# Altium schematic sheet Connectors.SchDoc: Science - Connectors
size Letter; DrawnBy: C.Arjune, K.Hong; Organization: UW Robotics; Address1: 200 University Avenue; Address2: Waterloo; Address3: Ontario; Address4: Canada N2L 3G6; SheetNumber: 2; SheetTotal: 5
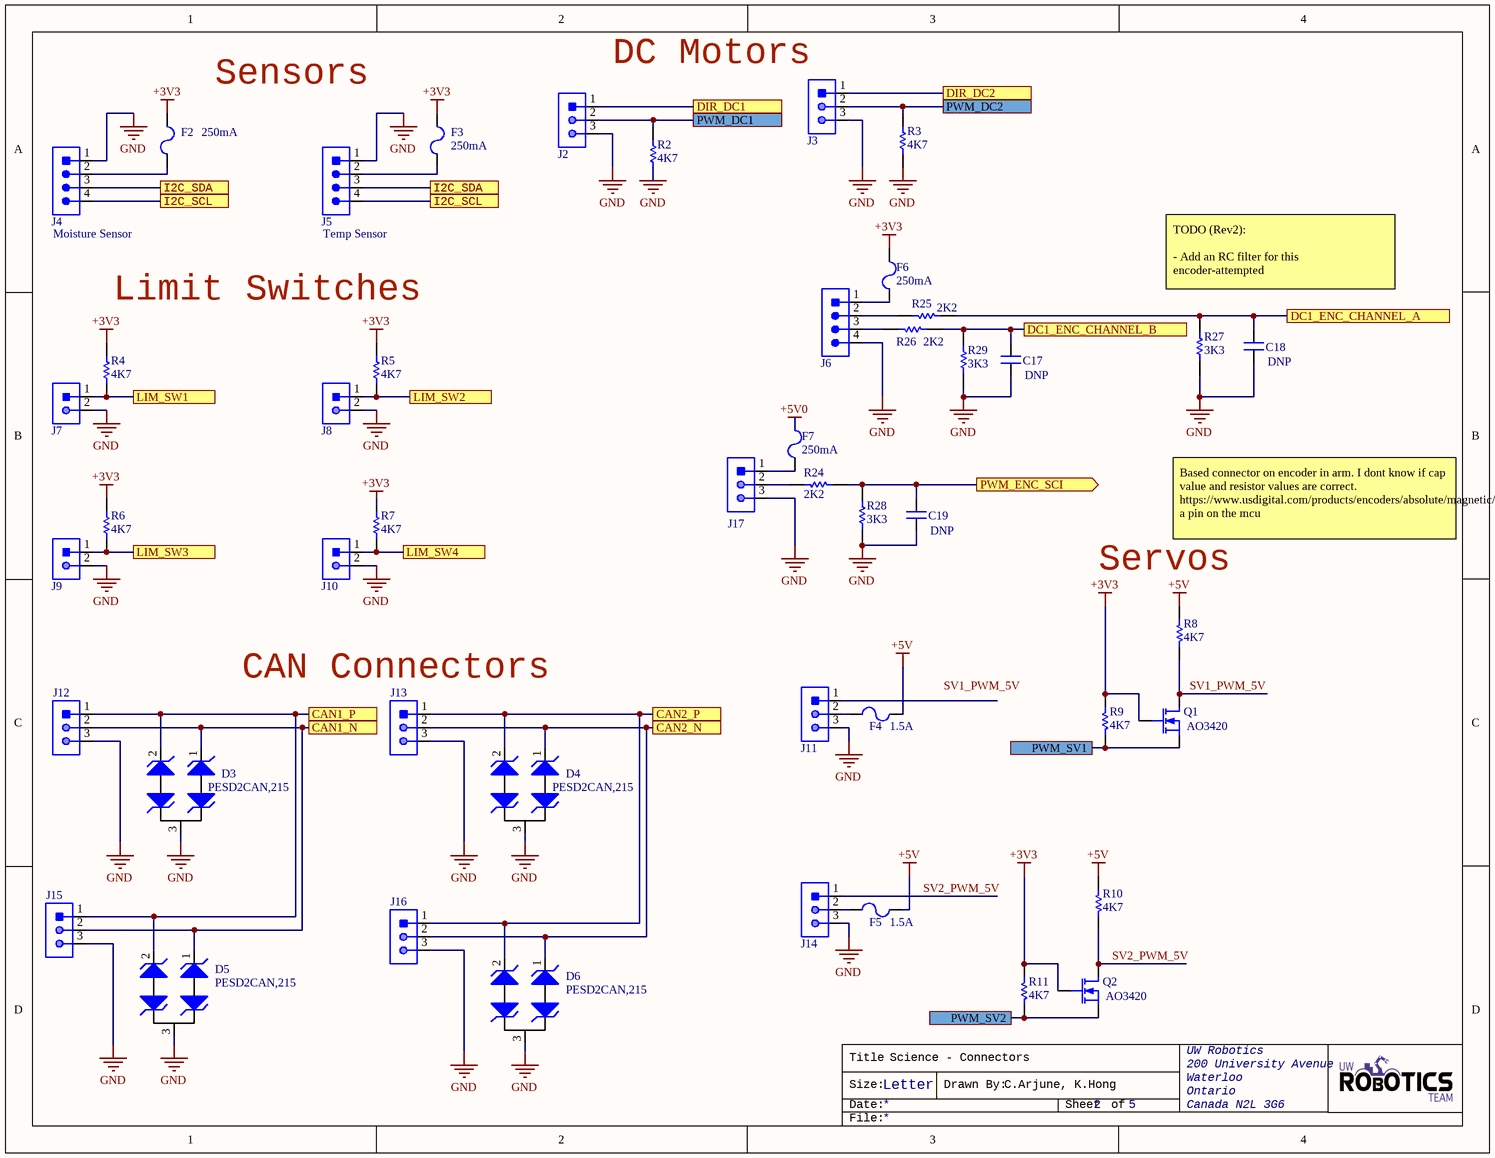
[diagram p0: Connectors.SchDoc]

## Parts
C17  value DNP  [CAPC0603(1608)55_N]  (hidden comment: CAP_0.1uF_50V_0603)
C18  value DNP  [CAPC0603(1608)55_N]  (hidden comment: CAP_0.1uF_50V_0603)
C19  value DNP  [CAPC0603(1608)55_N]  (hidden comment: CAP_0.1uF_50V_0603)
D3  Manufacturer Part Number: PESD2CAN,215  [TVS_DIODE_CAN]  (hidden comment: TVS_DIODE_CAN)
D4  Manufacturer Part Number: PESD2CAN,215  [TVS_DIODE_CAN]  (hidden comment: TVS_DIODE_CAN)
D5  Manufacturer Part Number: PESD2CAN,215  [TVS_DIODE_CAN]  (hidden comment: TVS_DIODE_CAN)
D6  Manufacturer Part Number: PESD2CAN,215  [TVS_DIODE_CAN]  (hidden comment: TVS_DIODE_CAN)
F2  Current Rating: 250mA  [FUSE_0603]  (hidden comment: FUSE_250mA_0603)
F3  Current Rating: 250mA  [FUSE_0603]  (hidden comment: FUSE_250mA_0603)
F4  Current Rating: 1.5A  [FUSE_0603]  (hidden comment: FUSE_1.5A_0603)
F5  Current Rating: 1.5A  [FUSE_0603]  (hidden comment: FUSE_1.5A_0603)
F6  Current Rating: 250mA  [FUSE_0603]  (hidden comment: FUSE_250mA_0603)
F7  Current Rating: 250mA  [FUSE_0603]  (hidden comment: FUSE_250mA_0603)
J2  CON_3M_SM4  [JST-B3B-SM4-TB]  (value not drawn)
J3  CON_3M_SM4  [JST-B3B-SM4-TB]  (value not drawn)
J4  Moisture Sensor  [JST-B4B-SM4-TB]
J5  Temp Sensor  [JST-B4B-SM4-TB]
J6  CON_4M_SM4  [JST-B4B-SM4-TB]  (value not drawn)
J7  CON_2M_SM4  [JST-B2B-SM4-TB]  (value not drawn)
J8  CON_2M_SM4  [JST-B2B-SM4-TB]  (value not drawn)
J9  CON_2M_SM4  [JST-B2B-SM4-TB]  (value not drawn)
J10  CON_2M_SM4  [JST-B2B-SM4-TB]  (value not drawn)
J11  CON_3M_SM4  [JST-B3B-SM4-TB]  (value not drawn)
J12  CON_3M_SM4  [JST-B3B-SM4-TB]  (value not drawn)
J13  CON_3M_SM4  [JST-B3B-SM4-TB]  (value not drawn)
J14  CON_3M_SM4  [JST-B3B-SM4-TB]  (value not drawn)
J15  CON_3M_SM4  [JST-B3B-SM4-TB]  (value not drawn)
J16  CON_3M_SM4  [JST-B3B-SM4-TB]  (value not drawn)
J17  CON_3M_SM4  [JST-B3B-SM4-TB]  (value not drawn)
Q1  MPN: AO3420  [NMOS_SOT23-3]  (hidden comment: NMOS_20V_6A)
Q2  MPN: AO3420  [NMOS_SOT23-3]  (hidden comment: NMOS_20V_6A)
R2  value 4K7  [RESC0603(1608)_N]  (hidden comment: RES_4K7_0603)
R3  value 4K7  [RESC0603(1608)_N]  (hidden comment: RES_4K7_0603)
R4  value 4K7  [RESC0603(1608)_N]  (hidden comment: RES_4K7_0603)
R5  value 4K7  [RESC0603(1608)_N]  (hidden comment: RES_4K7_0603)
R6  value 4K7  [RESC0603(1608)_N]  (hidden comment: RES_4K7_0603)
R7  value 4K7  [RESC0603(1608)_N]  (hidden comment: RES_4K7_0603)
R8  value 4K7  [RESC0603(1608)_N]  (hidden comment: RES_4K7_0603)
R9  value 4K7  [RESC0603(1608)_N]  (hidden comment: RES_4K7_0603)
R10  value 4K7  [RESC0603(1608)_N]  (hidden comment: RES_4K7_0603)
R11  value 4K7  [RESC0603(1608)_N]  (hidden comment: RES_4K7_0603)
R24  value 2K2  [RESC0603(1608)_N]  (hidden comment: RES_2K2_0603)
R25  value 2K2  [RESC0603(1608)_N]  (hidden comment: RES_2K2_0603)
R26  value 2K2  [RESC0603(1608)_N]  (hidden comment: RES_2K2_0603)
R27  value 3K3  [RESC0603(1608)_N]  (hidden comment: RES_3K3_0603)
R28  value 3K3  [RESC0603(1608)_N]  (hidden comment: RES_3K3_0603)
R29  value 3K3  [RESC0603(1608)_N]  (hidden comment: RES_3K3_0603)

## Ports
CAN1_N, CAN1_P, CAN2_N, CAN2_P, DC1_ENC_CHANNEL_A, DC1_ENC_CHANNEL_B, DIR_DC1, DIR_DC2, I2C_SCL, I2C_SDA, LIM_SW1, LIM_SW2, LIM_SW3, LIM_SW4, PWM_DC1, PWM_DC2, PWM_ENC_SCI (out), PWM_SV1, PWM_SV2

## Nets
+3V3: F2.1 F3.1 F6.2 Q1.1(G) Q2.1(G) R4.2 R5.2 R6.2 R7.2 R9.2 R11.2
+5V: F4.1 F5.1 R8.2 R10.2
+5V0: F7.2
GND: C17.1 C18.1 C19.1 D3.3 D4.3 D5.3 D6.3 J2.3 J3.3 J4.1 J5.1 J6.4 J7.2 J8.2 J9.2 J10.2 J11.3 J12.3 J13.3 J14.3 J15.3 J16.3 J17.3 R2.2 R3.2 R27.1 R28.1 R29.1
CAN1_N: D3.1 D5.1 J12.2 J15.2 ; port CAN1_N
CAN1_P: D3.2 D5.2 J12.1 J15.1 ; port CAN1_P
CAN2_N: D4.1 D6.1 J13.2 J16.2 ; port CAN2_N
CAN2_P: D4.2 D6.2 J13.1 J16.1 ; port CAN2_P
DC1_ENC_CHANNEL_A: C18.2 R25.1 R27.2 ; port DC1_ENC_CHANNEL_A
DC1_ENC_CHANNEL_B: C17.2 R26.1 R29.2 ; port DC1_ENC_CHANNEL_B
DIR_DC1: J2.1 ; port DIR_DC1
DIR_DC2: J3.1 ; port DIR_DC2
I2C_SCL: J4.4 J5.4 ; port I2C_SCL
I2C_SDA: J4.3 J5.3 ; port I2C_SDA
LIM_SW1: J7.1 R4.1 ; port LIM_SW1
LIM_SW2: J8.1 R5.1 ; port LIM_SW2
LIM_SW3: J9.1 R6.1 ; port LIM_SW3
LIM_SW4: J10.1 R7.1 ; port LIM_SW4
PWM_DC1: J2.2 R2.1 ; port PWM_DC1
PWM_DC2: J3.2 R3.1 ; port PWM_DC2
PWM_ENC_SCI: C19.2 R24.1 R28.2 ; port PWM_ENC_SCI
PWM_SV1: Q1.2(S) R9.1 ; port PWM_SV1
PWM_SV2: Q2.2(S) R11.1 ; port PWM_SV2
SV1_PWM_5V: Q1.3(D) R8.1
SV2_PWM_5V: J14.1 Q2.3(D) R10.1
NetF2_2: F2.2 J4.2
NetF3_2: F3.2 J5.2
NetF4_2: F4.2 J11.2
NetF5_2: F5.2 J14.2
NetF6_1: F6.1 J6.1
NetF7_1: F7.1 J17.1
NetJ6_2: J6.2 R25.2
NetJ6_3: J6.3 R26.2
NetJ17_2: J17.2 R24.2

Not connected (* = marked no-connect by the designer): J11 1

## Notes on the sheet
- Sensors
- DC Motors
- TODO (Rev2):
  - Add an RC filter for this encoder-attempted
- Limit Switches
- Based connector on encoder in arm. I dont know if cap value and resistor values are correct. https://www.usdigital.com/products/encoders/absolute/magnetic/MAE3needs a pin on the mcu
- (near R8) Servos
- (near J13) CAN Connectors
- Labels drawn without touching a wire or pin: SV1_PWM_5V
- Title
- Size:
- Date:
- Letter
- Drawn By:
- Sheet
- of
- File:

## Library data of the parts
C17-C19 = CAP_0.1uF_50V_0603: CAP CER 0.1UF 50V X7R 0603; MPN: CC0603KRX7R9BB104; Manufacturer: Yageo; Dimensions: 0.063" L x 0.031" W (1.60mm x 0.80mm); Package: 0603 (1608 Metric); Temperature Coefficient: X7R; Supplier Part Number 1: 311-1344-1-ND; Supplier 1: Digi-Key
D3-D6 = TVS_DIODE_CAN: TVS DIODE 24V 41V SOT323-3; Manufacturer: Nexperia USA Inc.; Package: SC-70, SOT-323; ComponentLink1Description: Datasheet; ComponentLink1URL: https://assets.nexperia.com/documents/data-sheet/PESD1CAN-U.pdf; Supplier Part Number 1: 1727-3891-1-ND; Supplier 1: Digi-Key
F2 F3 F6 F7 = FUSE_250mA_0603: FUSE SMD 250mA 32V; ComponentLink1URL: https://datasheet.ciiva.com/303/467-303396.pdf?src-supplier=Digi-Key; ComponentLink1Description: https://datasheet.ciiva.com/303/467-303396.pdf?src-supplier=Digi-Key; ComponentLink2URL: https://datasheet.ciiva.com/18652/littelfuse-fuse-467-datasheet-pdf-18652490.pdf?src-supplier=Digi-Key; ComponentLink2Description: https://datasheet.ciiva.com/18652/littelfuse-fuse-467-datasheet-pdf-18652490.pdf?src-supplier=Digi-Key; ComponentLink3URL: https://datasheet.ciiva.com/18652/littelfuse-fuse-467-datasheet-pdf-18652491.pdf?src-supplier=Digi-Key; ComponentLink3Description: https://datasheet.ciiva.com/18652/littelfuse-fuse-467-datasheet-pdf-18652491.pdf?src-supplier=Digi-Key; ComponentLink4URL: https://datasheet.ciiva.com/18652/littelfuse-fuse-467-datasheet-pdf-18652492.pdf?src-supplier=Digi-Key; ComponentLink4Description: https://datasheet.ciiva.com/18652/littelfuse-fuse-467-datasheet-pdf-18652492.pdf?src-supplier=Digi-Key; Voltage Rating (AC): 32V; Voltage Rating (DC): 32V; Supplier 1: Digi-Key; Supplier Part Number 1: F6020CT-ND; Supplier Packaging 1: Cut Tape; Mount: Surface Mount
F4 F5 = FUSE_1.5A_0603: FUSE SMD 1.5A 32V; ComponentLink1URL: https://datasheet.ciiva.com/26890/getdatasheetpartid-721713-26890390.pdf?src-supplier=Verical; ComponentLink1Description: https://datasheet.ciiva.com/26890/getdatasheetpartid-721713-26890390.pdf?src-supplier=Verical; ComponentLink2URL: https://datasheet.ciiva.com/7464/467-7464069.pdf?src-supplier=Digi-Key; ComponentLink2Description: https://datasheet.ciiva.com/7464/467-7464069.pdf?src-supplier=Digi-Key; ComponentLink3URL: https://datasheet.ciiva.com/7464/467-7464072.pdf?src-supplier=Digi-Key; ComponentLink3Description: https://datasheet.ciiva.com/7464/467-7464072.pdf?src-supplier=Digi-Key; Mount: Surface Mount; Voltage Rating (AC): 32V; Voltage Rating (DC): 32V; Supplier 1: Digi-Key; Supplier Part Number 1: F5702CT-ND; Supplier Packaging 1: Cut Tape
J2 J3 J11-J17 = CON_3M_SM4: CONN HEADER SMD 3POS 2MM; Manufacturer: JST; Manufacturer Part Number: B3B-PH-SM4-TB(LF)(SN); Max Current Rating: 2A; Max Voltage Rating: 100V; Supplier 1: Digi-Key; Supplier Part Number 1: 455-1735-1-ND; ComponentLink1URL: https://datasheet.ciiva.com/11747/0900766b80ddea81-11747684.pdf?src-supplier=RSComponents; ComponentLink1Description: https://datasheet.ciiva.com/11747/0900766b80ddea81-11747684.pdf?src-supplier=RSComponents; Pitch: 2mm
J4-J6 = CON_4M_SM4: CONN HEADER SMD 4POS 2MM; Manufacturer: JST; Manufacturer Part Number: B4B-PH-SM4-TB(LF)(SN); Max Current Rating: 2A; Max Voltage Rating: 100V; Supplier 1: Digi-Key; Supplier Part Number 1: 455-1736-1-ND; ComponentLink1URL: https://datasheet.ciiva.com/8052/1699381-8052048.pdf?src-supplier=Element14; ComponentLink1Description: https://datasheet.ciiva.com/8052/1699381-8052048.pdf?src-supplier=Element14; ComponentLink2URL: https://datasheet.ciiva.com/11747/0900766b80ddea81-11747504.pdf?src-supplier=RSComponents; ComponentLink2Description: https://datasheet.ciiva.com/11747/0900766b80ddea81-11747504.pdf?src-supplier=RSComponents; ComponentLink3URL: https://datasheet.ciiva.com/6747/80567-6747409.pdf?src-supplier=Newark; ComponentLink3Description: https://datasheet.ciiva.com/6747/80567-6747409.pdf?src-supplier=Newark; ComponentLink4URL: https://datasheet.ciiva.com/727/eph-727525.pdf?src-supplier=Digi-Key; ComponentLink4Description: https://datasheet.ciiva.com/727/eph-727525.pdf?src-supplier=Digi-Key; ComponentLink5URL: https://datasheet.ciiva.com/712/eph-712582.pdf?src-supplier=Digi-Key; ComponentLink5Description: https://datasheet.ciiva.com/712/eph-712582.pdf?src-supplier=Digi-Key; ComponentLink6URL: https://datasheet.ciiva.com/712/eph-712583.pdf?src-supplier=Digi-Key; ComponentLink6Description: https://datasheet.ciiva.com/712/eph-712583.pdf?src-supplier=Digi-Key; Pitch: 2mm
J7-J10 = CON_2M_SM4: CONN HEADER SMD 2POS 2MM; Manufacturer: JST; Manufacturer Part Number: B2B-PH-SM4-TB(LF)(SN); Max Current Rating: 2A; Max Voltage Rating: 100V; Supplier 1: Digi-Key; Supplier Part Number 1: 455-1734-1-ND; ComponentLink1URL: https://datasheet.ciiva.com/11748/0900766b80ddea81-11748001.pdf?src-supplier=RSComponents; ComponentLink1Description: https://datasheet.ciiva.com/11748/0900766b80ddea81-11748001.pdf?src-supplier=RSComponents; ComponentLink2URL: https://datasheet.ciiva.com/16216/b2b-ph-sm4-tblfsn-16216102.pdf?src-supplier=Future+Electronics; ComponentLink2Description: https://datasheet.ciiva.com/16216/b2b-ph-sm4-tblfsn-16216102.pdf?src-supplier=Future+Electronics; ComponentLink3URL: https://datasheet.ciiva.com/8052/80567-8052023.pdf?src-supplier=Element14; ComponentLink3Description: https://datasheet.ciiva.com/8052/80567-8052023.pdf?src-supplier=Element14; ComponentLink4URL: https://datasheet.ciiva.com/712/eph-712504.pdf?src-supplier=Digi-Key; ComponentLink4Description: https://datasheet.ciiva.com/712/eph-712504.pdf?src-supplier=Digi-Key; ComponentLink5URL: https://datasheet.ciiva.com/712/eph-712505.pdf?src-supplier=Digi-Key; ComponentLink5Description: https://datasheet.ciiva.com/712/eph-712505.pdf?src-supplier=Digi-Key; ComponentLink6URL: https://datasheet.ciiva.com/712/eph-712506.pdf?src-supplier=Digi-Key; ComponentLink6Description: https://datasheet.ciiva.com/712/eph-712506.pdf?src-supplier=Digi-Key; Pitch: 2mm
Q1 Q2 = NMOS_20V_6A: MOSFET N-CH 20V 6A SOT23; Manufacturer: Alpha & Omega; Package: TO-236-3, SC-59, SOT-23-3; ComponentLink1Description: Datasheet; ComponentLink1URL: http://aosmd.com/res/data_sheets/AO3420.pdf; Supplier Part Number 1: 785-1014-1-ND; Supplier 1: Digi-Key
R2-R11 = RES_4K7_0603: RES SMD 4.7K OHM 5% 1/10W 0603; Manufacturer: Yageo; MPN: RC0603JR-074K7L; Package: 0603 (1608 Metric); Dimensions: 0.063" L x 0.031" W (1.60mm x 0.80mm); Tolerance: 5%; Supplier Part Number 1: 311-4.7KGRCT-ND; Supplier 1: Digi-Key
R24-R26 = RES_2K2_0603: RES SMD 2.2K OHM 1% 1/10W 0603; Manufacturer: Yageo; MPN: RC0603FR-072K2L; Dimensions: 0.063" L x 0.031" W (1.60mm x 0.80mm); Package: 0603 (1608 Metric); Tolerance: 1%; Supplier 1: Digi-Key; Supplier Part Number 1: 311-2.20KHRCT-ND
R27-R29 = RES_3K3_0603: RES SMD 3.3K OHM 5% 1/10W 0603; Manufacturer: Yageo; MPN: RC0603JR-073K3L; Dimensions: 0.063" L x 0.031" W (1.60mm x 0.80mm); Package: 0603 (1608 Metric); Tolerance: 5%; Supplier Part Number 1: 311-3.3KGRCT-ND; Supplier 1: Digi-Key; Digikey Part Number: 311-3.3KGRCT-ND